# EAGLE design simpleL6470_v2 (EAGLE 9.1.1)
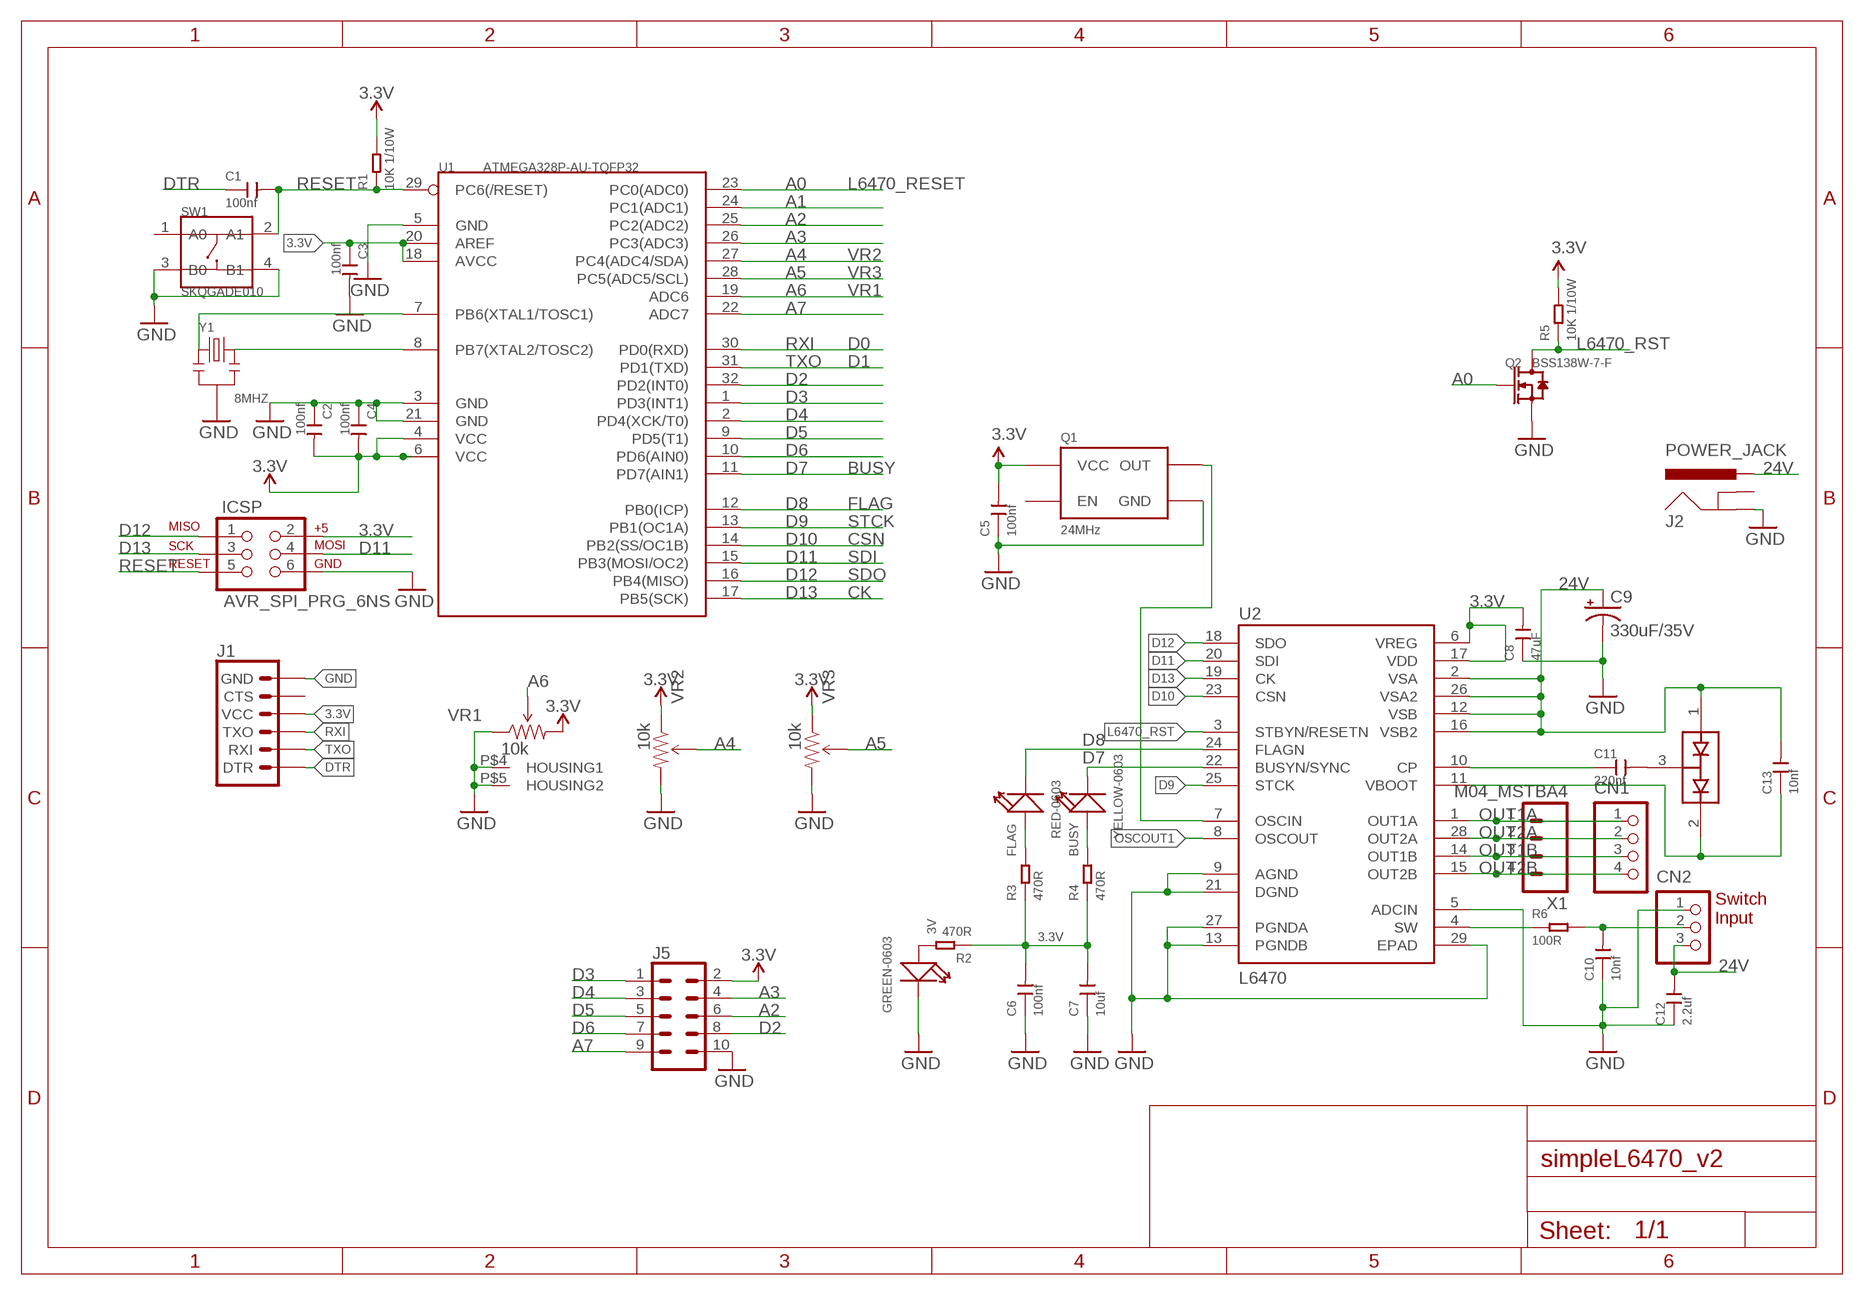
[diagram p0: schematic, sheet 1]

## Parts
3V  GREEN-0603  SMD-LED-CLEAR-GREEN(0603)  [LED-0603]
BUSY  YELLOW-0603  SMD-LED-CLEAR-YELLOW(0603)  [LED-0603]
C1  100nf  CERAMIC-100NF-50V-10%-X7R(0603)  [C0603]
C2  100nf  CERAMIC-100NF-50V-10%-X7R(0603)  [C0603]
C3  100nf  CERAMIC-100NF-50V-10%-X7R(0603)  [C0603]
C4  100nf  CERAMIC-100NF-50V-10%-X7R(0603)  [C0603]
C5  100nf  CERAMIC-100NF-50V-10%-X7R(0603)  [C0603]
C6  100nf  CERAMIC-100NF-50V-10%-X7R(0603)  [C0603]
C7  10uf  CERAMIC-10UF-10V-(-20%～+80%)-Y5V(0805)  [C0805]
C8  47uF  CERAMIC-100UF-6.3V-20%-X5R(1206)  [C1206]
C9  330uF/35V  C_POLD10  [NICHICON_D10]
C10  10nf  CERAMIC-10NF-50V-10%-X7R(0603)  [C0603]
C11  220nf  CERAMIC-220NF-25V-10%-X7R(0603)  [C0603]
C12  2.2uf  CERAMIC-2.2UF-25V-10%-X7R(0805)  [C0805]
C13  10nf  CERAMIC-10NF-50V-10%-X7R(0402)  [C0402]
CN1  S4B-XASK-1  [S4B-XASK-1]
CN2  B3B-XASK-1  [B3B-XASK-1]
D4  BAV99  [SOT23]
FLAG  RED-0603  LED-SMD-RED-DIFFUSED(0603)  [LED-0603]
ICSP  AVR_SPI_PRG_6NS  [2X3-NS]
J1  6_PIN_SERIAL_TARGETLOCK  [1X06_LOCK]
J2  POWER_JACK  [POWER_JACK_PTH]
J5  CONN_05X2NO_SILK  [2X5_NOSILK]
Q1  24MHz  CRYSTAL_OSC3.2X2.5  [CRYSTAL-OSC-SMD-3.2X2.5]
Q2  BSS138W-7-F  SMD-MOSFET-N-CH-50V-200MA-BSS138W-7-F(SOT-23)  [SOT-23]
R1  10K 1/10W  SMD-RES-10K-5%-1/10W(0603)  [R0603]
R2  470R  SMD-RES-470R-5%-1/10W(0603)  [R0603]
R3  470R  SMD-RES-470R-5%-1/10W(0603)  [R0603]
R4  470R  SMD-RES-470R-5%-1/10W(0603)  [R0603]
R5  10K 1/10W  SMD-RES-10K-5%-1/10W(0603)  [R0603]
R6  100R  SMD-RES-100R-5%-1/10W(0603)  [R0603]
SW1  SKQGADE010  SMD-BUTTON(4P-5.2X5.2X1.5MM-SKQGADE010)-SKQGADE010  [SW4-SMD-5.2X5.2X1.5MM]
U1  ATMEGA328P-AU-TQFP32  MCU-ATMEGA328P-AU(TQFP32)  [TQFP32-0.8-7X7MM]
U2  L6470  L6470_NO_THERMAL  [HTSSOP28_NO_THERMAL]
VR1  10k  TRIMVR_HOUSING_RK09  [RK09]
VR2  10k  TRIMVR_T73XX  [TRIMMER_T73XX]
VR3  10k  TRIMVR_T73XX  [TRIMMER_T73XX]
X1  M04_MSTBA4  [MSTBA4]
Y1  8MHZ  SMD-CRYSTAL-8MHZ--0.3%-150R(3P-3.6X1.3MM)  [X3-SMD-3.6X1.3X0.8MM]

## Nets
3.3V [GND_]: C2.2 C3.1 C4.2 C5.2 C6.2 C7.2 C8.2 ICSP.2 J1.4(VCC) J5.2 Q1.4(VCC) R1.2 R2.1 R3.1 R4.1 R5.2 U1.4(VCC) U1.6(VCC) U1.18(AVCC) U1.20(AREF) U2.6(VREG) U2.17(VDD) VR1.3(CW) VR2.P$1(CCW) VR3.P$1(CCW)
24V: C9.+ C12.2 C13.2 CN2.3 D4.1(A1) J2.PWR U2.2(VSA) U2.12(VSB) U2.16(VSB2) U2.26(VSA2)
A0: Q2.1(G) U1.23(PC0(ADC0))
A1: U1.24(PC1(ADC1))
A2: J5.6 U1.25(PC2(ADC2))
A3: J5.4 U1.26(PC3(ADC3))
A4: U1.27(PC4(ADC4/SDA)) VR2.P$2(WIPER)
A5: U1.28(PC5(ADC5/SCL)) VR3.P$2(WIPER)
A6: U1.19(ADC6) VR1.2(WIPER)
A7: J5.9 U1.22(ADC7)
D2: J5.8 U1.32(PD2(INT0))
D3: J5.1 U1.1(PD3(INT1))
D4: J5.3 U1.2(PD4(XCK/T0))
D5: J5.5 U1.9(PD5(T1))
D6: J5.7 U1.10(PD6(AIN0))
D7: BUSY.- U1.11(PD7(AIN1)) U2.22(BUSYN/SYNC)
D8: FLAG.- U1.12(PB0(ICP)) U2.24(FLAGN)
D9: U1.13(PB1(OC1A)) U2.25(STCK)
D10: U1.14(PB2(SS/OC1B)) U2.23(CSN)
D11: ICSP.4 U1.15(PB3(MOSI/OC2)) U2.20(SDI)
D12: ICSP.1 U1.16(PB4(MISO)) U2.18(SDO)
D13: ICSP.3 U1.17(PB5(SCK)) U2.19(CK)
DTR: C1.1 J1.1(DTR)
GND: 3V.- C2.1 C3.2 C4.1 C5.1 C6.1 C7.1 C8.1 C9.- C10.1 C12.1 CN2.1 ICSP.6 J1.6(GND) J2.GND J5.10 Q1.2(GND) Q2.2(S) SW1.3(B0) SW1.4(B1) U1.3(GND) U1.5(GND) U1.21(GND) U2.5(ADCIN) U2.9(AGND) U2.13(PGNDB) U2.21(DGND) U2.27(PGNDA) U2.29(EPAD) VR1.1(CCW) VR1.P$4(HOUSING1) VR1.P$5(HOUSING2) VR2.P$3(CW) VR3.P$3(CW) Y1.2
L6470_RST: Q2.3(D) R5.1 U2.3(STBYN/RESETN)
N$1: FLAG.+ R3.2
N$2: BUSY.+ R4.2
N$3: C11.2 D4.3(COM)
N$4: 3V.+ R2.2
N$18: U1.7(PB6(XTAL1/TOSC1)) Y1.1
N$20: U1.8(PB7(XTAL2/TOSC2)) Y1.3
N$42: C11.1 U2.10(CP)
N$44: C13.1 D4.2(C2) U2.11(VBOOT)
N$45: R6.1 U2.4(SW)
N$46: C10.2 CN2.2 R6.2
OSCOUT1: U2.8(OSCOUT)
OUT1A: CN1.1 U2.1(OUT1A) X1.1
OUT1B: CN1.3 U2.14(OUT1B) X1.3
OUT2A: CN1.2 U2.28(OUT2A) X1.2
OUT2B: CN1.4 U2.15(OUT2B) X1.4
QGOUT: Q1.3(OUT) U2.7(OSCIN)
RESET: C1.2 ICSP.5 R1.1 SW1.2(A1) U1.29(PC6(/RESET))
RXI: J1.3(TXO) U1.30(PD0(RXD))
TXO: J1.2(RXI) U1.31(PD1(TXD))
Unconnected: J1.5(CTS) J2.GNDBREAK Q1.1(EN) SW1.1(A0)

## Notes on the sheet
- L6470_RESET
- VR2
- VR3
- VR1
- D0
- D1
- BUSY
- FLAG
- STCK
- CSN
- SDI
- SDO
- CK
- Switch
  Input

## Library data of the parts
3V = Seeed-LED:SMD-LED-CLEAR-GREEN(0603): 304090043; MPN: 19-217-G7C-AN1P2-3T
BUSY = Seeed-LED:SMD-LED-CLEAR-YELLOW(0603): 304090044; MPN: 19-217-Y5C-AM1N1VY-3T
C1-C6 = Seeed-Capacitor:CERAMIC-100NF-50V-10%-X7R(0603): 302010138; MPN: CC0603KRX7R9BB104
C7 = Seeed-Capacitor:CERAMIC-10UF-10V-(-20%～+80%)-Y5V(0805): 302010158; MPN: CC0805ZKY5V6BB106
C8 = Seeed-Capacitor:CERAMIC-100UF-6.3V-20%-X5R(1206): 302010183; MPN: GRM31CR60J107ME39L; VALUE: 100uf
C9 = _kantaParts:C_POL: Nippon Chemi-Con 3300uF/50V KMH50VSSN3300M P-01590 <http://akizukidenshi.com/catalog/g/gP-01590/>
C10 = Seeed-Capacitor:CERAMIC-10NF-50V-10%-X7R(0603): 302010140; MPN: CC0603KRX7R9BB103
C11 = Seeed-Capacitor:CERAMIC-220NF-25V-10%-X7R(0603): 302010073; MPN: CC0603KRX7R8BB224
C12 = Seeed-Capacitor:CERAMIC-2.2UF-25V-10%-X7R(0805): 302010148; MPN: CC0805KKX7R8BB225
C13 = Seeed-Capacitor:CERAMIC-10NF-50V-10%-X7R(0402): 302010006; MPN: CC0402KRX7R9BB103
CN1 = jst-xa:S4B-XASK-1: Wire-to-Board 2.5mm pitch top mount connector Source: http://www.jst-mfg.com/product/pdf/jpn/XA1.pdf http://www.jst-mfg.com/product/detail.php?series=272
CN2 = jst-xa:B3B-XASK-1: Wire-to-Board 2.5mm pitch top mount connector Source: http://www.jst-mfg.com/product/pdf/jpn/XA1.pdf http://www.jst-mfg.com/product/detail.php?series=272
D4 = SparkFun-DiscreteSemi:BAV99: Two small signal silicon diodes connected anode to cathode. Connections to all three nodes available. DIO-10647; PROD_ID: DIO-10647
FLAG = Seeed-LED:LED-SMD-RED-DIFFUSED(0603): 304090042; MPN: 19-217-R6C-AL1M2VY-3T
ICSP = SparkFun-Connectors:AVR_SPI_PRG_6: AVR ISP 6 Pin This is the reduced ISP connector for AVR programming. Common on Arduino. This footprint will take up less PCB space and can be used with a 10-pin to 6-pin adapter such as SKU: BOB-08508 **Special note about "TEST_POINT" package. The stop mask is on the top side, so if you want your programming test points to be on the bottom of your board, make sure to place this package on the bottom side of the board. This also ensure that the orientation to program from the bottom side will be correct.
J1 = SparkFun-Connectors:6_PIN_SERIAL_TARGET: 6-pin header connection for use with the "FTDI BASIC" pinout - TARGET SIDE. Also known as "Arduino Serial Program Header". It is used to mate with our FTDI Basic serial programmers using the Arduino IDE. Note, this device has "TARGET" in the name. It is intended to be used on a design that contains a target micro-controller that you wish to program. The "sister" device, named "CABLE" is inteneded to be used on a design that usually lives on the end of your USB cable and prvides the converter chip (FTDI232 or FTDI231x) to commnicate serial RX/TX. You can populate with some of these: Break Away Headers - Straight <https://www.sparkfun.com/products/116> (PRT-00116) For reference (or to suit your programming needs) check out these designs: SparkFun FTDI Basic Breakout - 5V <https://www.sparkfun.com/products/9716> (DEV-09716) SparkFun FTDI Basic Breakout - 3.3V <https://www.sparkfun.com/products/9873> (DEV-09873) SparkFun FTDI SmartBasic <https://www.sparkfun.com/products/12935> (DEV-12935) SparkFun Beefy 3 - FTDI Basic Breakout <https://www.sparkfun.com/products/13746> (DEV-13746)
J2 = SparkFun-Connectors:POWER_JACK: Power Jack Connector This is the standard 5.5mm barrel jack for power. The PTH is the most common, proven, reliable, footprint. The Slot footprint only works if the mill layer is transmitted to the PCB fab house so be warned. Here are the connectors we sell at SparkFun: DC Barrel Power Jack/Connector <https://www.sparkfun.com/products/119> (PRT-00119) DC Barrel Power Jack/Connector (SMD) <https://www.sparkfun.com/products/12748> (PRT-12748) DC Barrel Jack Adapter - Breadboard Compatible <https://www.sparkfun.com/products/10811> (PRT-10811) It is used on this SparkFun product (and many, many others): SparkFun RedBoard - Programmed with Arduino <https://www.sparkfun.com/products/12757> (DEV-12757) Also, if you need a mating power supply or connector, please check these out: Wall Adapter Power Supply - 9VDC 650mA <https://www.sparkfun.com/products/298> (TOL-00298) DC Barrel Jack Adapter - Male <https://www.sparkfun.com/products/10287> (PRT-10287); PROD_ID: CONN-08197
J5 = SparkFun-Connectors:CONN_05X2: Multi connection point. Often used as Generic Header-pin footprint for 0.1 inch spaced/style header connections For AVR SPI programming port, see special device with nice symbol: "AVR_SPI_PROG_5x2.dev" You can populate with any combo of single row headers, but if you'd like an exact match, check these: 2x5 AVR ICSP Male Header <https://www.sparkfun.com/products/778> (PRT-00778) 2x5 Pin Shrouded Header <https://www.sparkfun.com/products/8506> (PRT-08506) On any of the 0.1 inch spaced packages, you can populate with these: Break Away Headers - Straight <https://www.sparkfun.com/products/116> (PRT-00116) Break Away Male Headers - Right Angle <https://www.sparkfun.com/products/553> (PRT-00553) Female Headers <https://www.sparkfun.com/products/115> (PRT-00115) Break Away Headers - Machine Pin <https://www.sparkfun.com/products/117> (PRT-00117) Break Away Female Headers - Swiss Machine Pin <https://www.sparkfun.com/products/743> (PRT-00743) Special note: the shrouded connector mates well with our 5x2 ribbon cables: 2x5 Pin IDC Ribbon Cable <https://www.sparkfun.com/products/8535> (PRT-08535)
Q1 = _kantaParts:CRYSTAL_OSC
Q2 = Seeed-Transistor:SMD-MOSFET-N-CH-50V-200MA-BSS138W-7-F(SOT-23): 305030000; MPN: BSS138W-7-F
R1 R5 = Seeed-Resistor:SMD-RES-10K-5%-1/10W(0603): 301010293; MPN: RC0603JR-0710KL
R2-R4 = Seeed-Resistor:SMD-RES-470R-5%-1/10W(0603): 301010088; MPN: RC0603JR-07470RL
R6 = Seeed-Resistor:SMD-RES-100R-5%-1/10W(0603): 301010090; MPN: RC0603JR-07100RL
SW1 = Seeed-Switch:SMD-BUTTON(4P-5.2X5.2X1.5MM-SKQGADE010): 311020017; MPN: SKQGADE010
U1 = Seeed-IC:MCU-ATMEGA328P-AU(TQFP32): 310010049; MPN: ATMEGA328P-AU
U2 = SparkFun-PowerIC:L6470: 3A RMS/7A peak bipolar stepper motor driver with SPI control and step input in HTSSOP-28 package. IC-10648
VR1 = _kantaParts:TRIMVR_HOUSING: Trimmer VR with housing terminal RK09 ALPS without center click : RS 154-8162 <https://jp.rs-online.com/web/p/potentiometers/1548162/> with center click : RS 729-3603 <https://jp.rs-online.com/web/p/potentiometers/7293603/>
VR2 VR3 = _kantaParts:TRIMVR: SUNTAN 3386K Series Akiduki : P-06110 <http://akizukidenshi.com/catalog/g/gP-06110/> SMD VR ST-32EB Copal Electronics / Surface Mount Trimmer RS : 474-8706 Trimmer BOURNS 3392P Series Akiduki P-03277 <http://akizukidenshi.com/catalog/g/gP-03277/> details : http://www.bourns.com/pdfs/3362.pdf
X1 = _kantaParts:M04: Round Pin Socket with slim pads Akiduki P-01015 <http://akizukidenshi.com/catalog/g/gP-01015/>
Y1 = Seeed-Crystal Oscillator:SMD-CRYSTAL-8MHZ--0.3%-150R(3P-3.6X1.3MM): 306010053

## Board
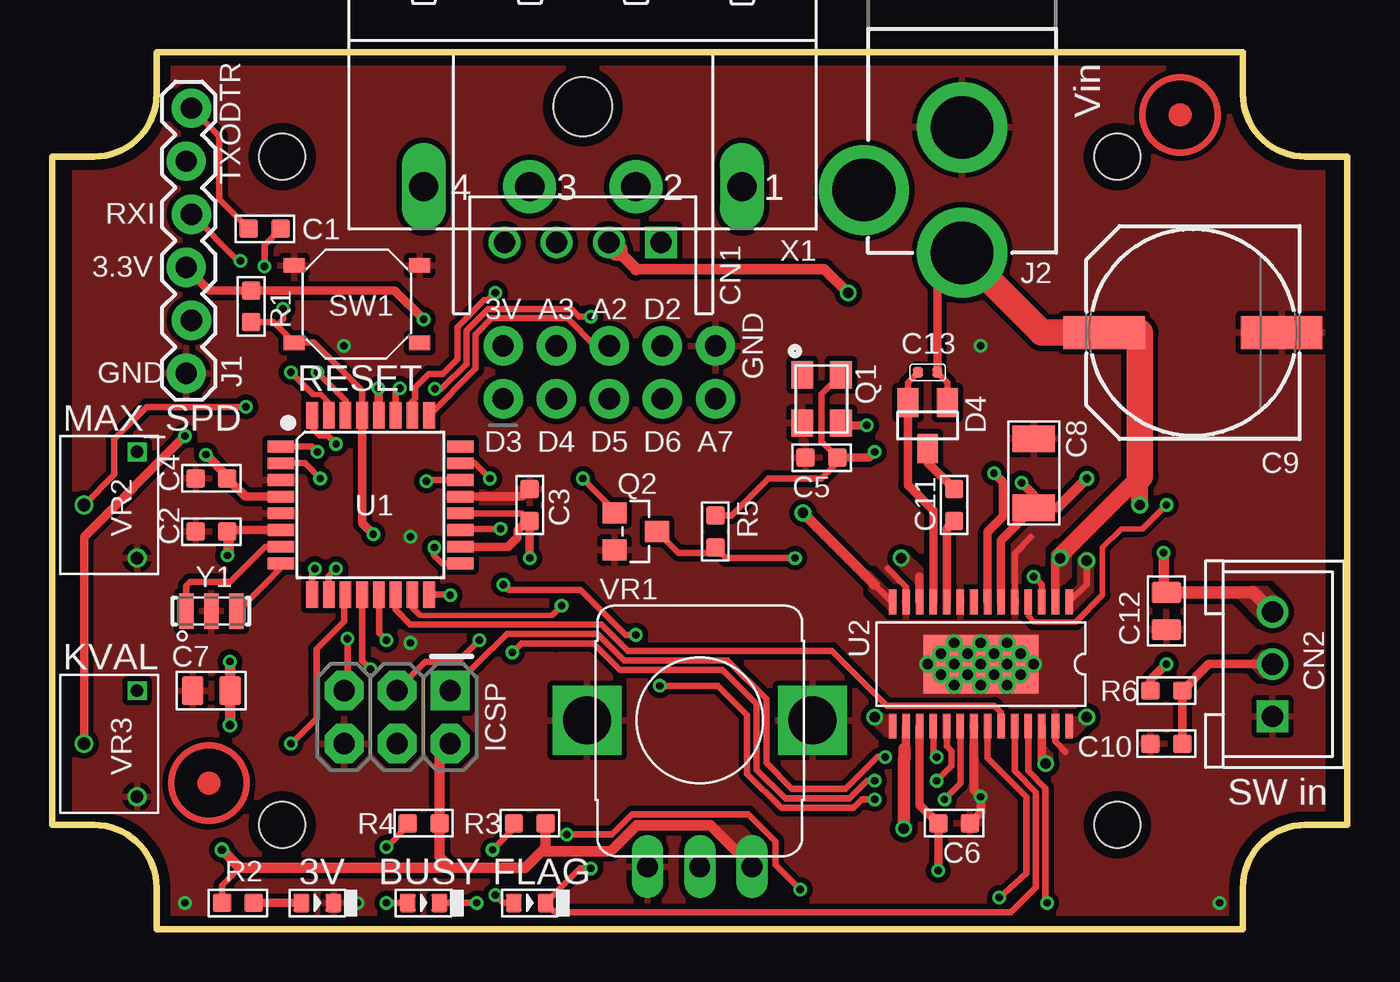
[diagram p1: board, top side]
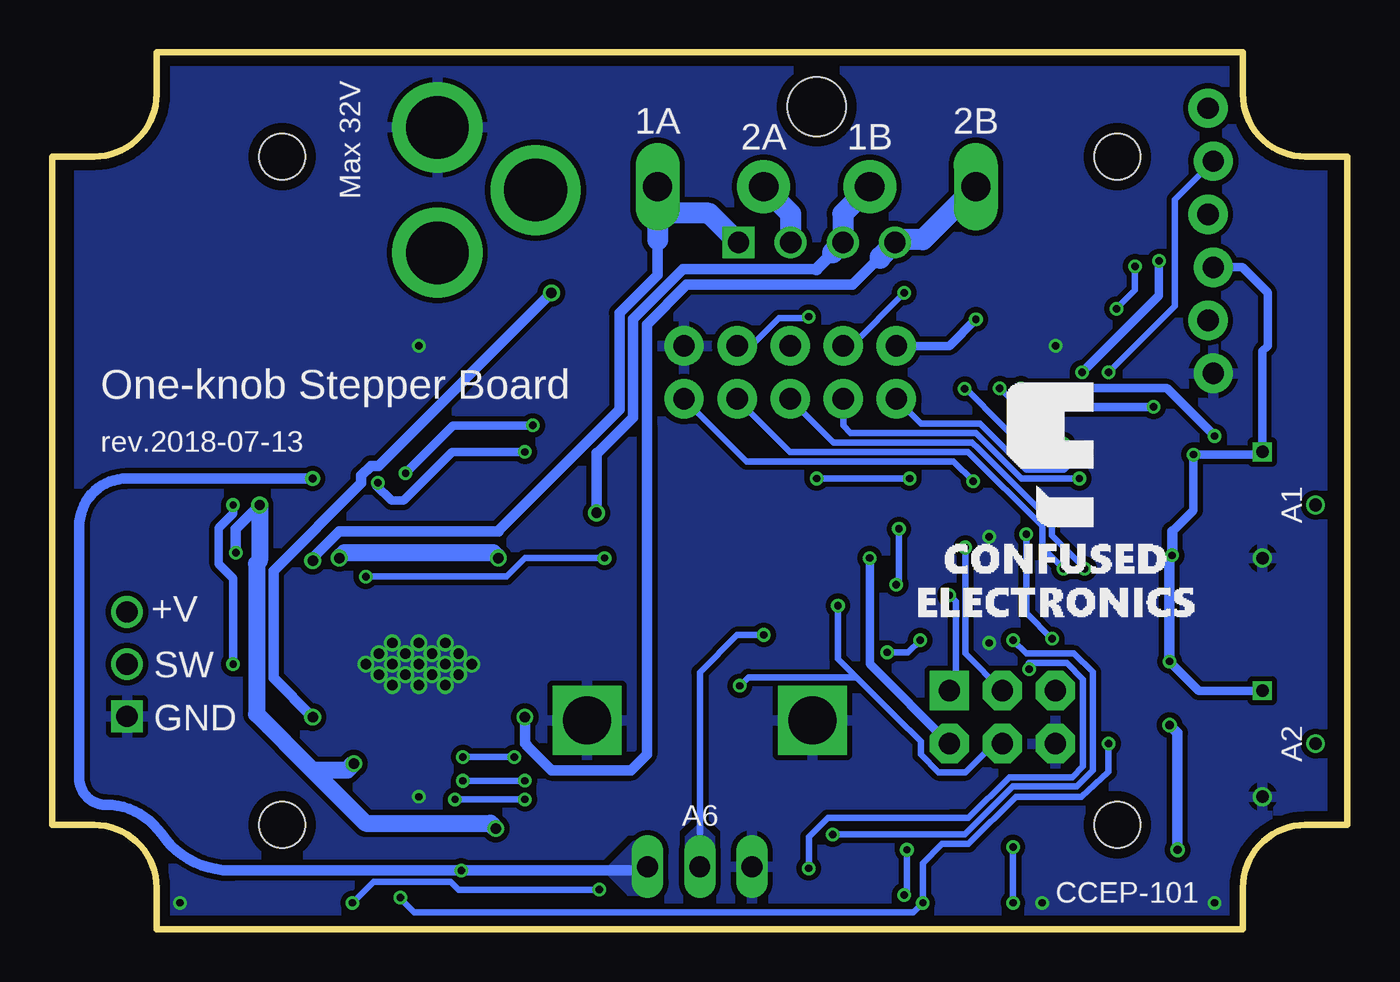
[diagram p2: board, bottom side, seen from below]

Size 62 x 42 mm. Coordinates in mm from the lower left corner, seen from the top.
Outline: 0,5 2,5 arc-90 5,2 5,0 57,0 57,2 arc-90 60,5 62,5 62,37 60,37 arc-90 57,40 57,42 5,42 5,40 arc-90 2,37 0,37 0,5
Copper layers (1*16): Top 0.035mm / dielectric 1.53mm / Bottom 0.035mm
Design rules "pban_5mil-l2": minimum track width 5mil, minimum drill 0.3mm, track to track 5mil, track to pad 0.229mm, pad to pad 5mil, via to via 5mil, smd to smd 5mil, copper to edge 0.5mm, drill to drill 0.5mm, minimum pad ring 0.15mm, minimum via ring 0.15mm, stop-mask expansion 4mil, vias tented up to drill 0.35mm, thermal gap 10mil
Holes 2.2 mm at 11,5 51,5 11,37 51,37
tRestrict: area 61.2,5 to 62,37; area 0,5 to 0.7,37
bRestrict: area 61.2,5 to 62,37; area 0,5 to 0.7,37

### Footprints (pad centres in the part's own frame; a part is rotated, then mirrored left to right if it is on the bottom)
LED-0603 = smd 0.762 x 0.889: + -0.762,0; - 0.762,0
C0603 = smd 0.889 x 0.889: 1 0,0.762; 2 0,-0.762
C0805 = smd 1.397 x 1.016: 1 0,0.889; 2 0,-0.889
C1206 = smd 1.27 x 2.032: 1 -1.651,0; 2 1.651,0
NICHICON_D10 = smd 3.9 x 1.6: + 4.25,0; - -4.25,0
C0402 = smd 0.5 x 0.5: 1 0,0.463; 2 0,-0.463
S4B-XASK-1 = drill 1.016 square: 1 3.75,0 | drill 1.016: 2 1.25,0; 3 -1.25,0; 4 -3.75,0 | hole 2.8: 0,6.5
B3B-XASK-1 = drill 1.016 square: 1 -2.5,0 | drill 1.016: 2 0,0; 3 2.5,0
SOT23 = smd 1 x 1.4: 1 -0.95,-1.1; 2 0.95,-1.1; 3 0,1.1
2X3-NS = drill 1.016 pad 1.88 square: 1 -2.54,-1.27 | drill 1.016 pad 1.88 octagon: 2 -2.54,1.27; 3 0,-1.27; 4 0,1.27; 5 2.54,-1.27; 6 2.54,1.27
1X06_LOCK = drill 1.016 pad 1.88: 1 0,0; 2 2.54,-0.254; 3 5.08,0; 4 7.62,-0.254; 5 10.16,0; 6 12.7,-0.254
POWER_JACK_PTH = drill 2.997 pad 4.318: GND 0,7.7; GNDBREAK 4.7,10.7; PWR 0,13.7
2X5_NOSILK = drill 1.016 pad 1.88: 1 0,0; 2 0,2.54; 3 2.54,0; 4 2.54,2.54; 5 5.08,0; 6 5.08,2.54; 7 7.62,0; 8 7.62,2.54; 9 10.16,0; 10 10.16,2.54
CRYSTAL-OSC-SMD-3.2X2.5 = smd 1.3 x 1.05: 1 -1.15,-0.925; 2 1.15,-0.925; 3 1.15,0.925; 4 -1.15,0.925
SOT-23 = smd 1.016 x 1.143: 1 -0.889,-1.016; 2 0.889,-1.016; 3 0,1.016
R0603 = smd 0.889 x 0.889: 1 0,0.762; 2 0,-0.762
SW4-SMD-5.2X5.2X1.5MM = smd 1 x 0.7: 1 -3,1.85; 2 3,1.85; 3 -3,-1.85; 4 3,-1.85
TQFP32-0.8-7X7MM = smd 1.27 x 0.559: 1 -4.293,2.8; 2 -4.293,2; 3 -4.293,1.2; 4 -4.293,0.4; 5 -4.293,-0.4; 6 -4.293,-1.2; 7 -4.293,-2; 8 -4.293,-2.8; 17 4.293,-2.8; 18 4.293,-2; 19 4.293,-1.2; 20 4.293,-0.4; 21 4.293,0.4; 22 4.293,1.2; 23 4.293,2; 24 4.293,2.8 | smd 0.559 x 1.27: 9 -2.8,-4.293; 10 -2,-4.293; 11 -1.2,-4.293; 12 -0.4,-4.293; 13 0.4,-4.293; 14 1.2,-4.293; 15 2,-4.293; 16 2.8,-4.293; 25 2.8,4.293; 26 2,4.293; 27 1.2,4.293; 28 0.4,4.293; 29 -0.4,4.293; 30 -1.2,4.293; 31 -2,4.293; 32 -2.8,4.293
HTSSOP28_NO_THERMAL = smd 0.36 x 1.19: 1 -4.225,-2.97; 2 -3.575,-2.97; 3 -2.925,-2.97; 4 -2.275,-2.97; 5 -1.625,-2.97; 6 -0.975,-2.97; 7 -0.325,-2.97; 8 0.325,-2.97; 9 0.975,-2.97; 10 1.625,-2.97; 11 2.275,-2.97; 12 2.925,-2.97; 13 3.575,-2.97; 14 4.225,-2.97; 15 4.225,2.97; 16 3.575,2.97; 17 2.925,2.97; 18 2.275,2.97; 19 1.625,2.97; 20 0.975,2.97; 21 0.325,2.97; 22 -0.325,2.97; 23 -0.975,2.97; 24 -1.625,2.97; 25 -2.275,2.97; 26 -2.925,2.97; 27 -3.575,2.97; 28 -4.225,2.97 | smd 5.5 x 2.8: 29 0,0
RK09 = drill 1 long: 1 -2.5,-7; 2 0,-7; 3 2.5,-7 | drill 2.3 square: P$4 -5.4,0; P$5 5.4,0
TRIMMER_T73XX = drill 0.6 square: P$1 -2.54,-2.54 | drill 0.6: P$2 0,0; P$3 -2.54,2.54
MSTBA4 = drill 1.397 long: 1 -7.62,5.08; 4 7.62,5.08 | drill 1.397 pad 2.54: 2 -2.54,5.08; 3 2.54,5.08
X3-SMD-3.6X1.3X0.8MM = smd 0.7 x 1.7: 1 -1.2,0; 2 0,0; 3 1.2,0

### Placement (x,y rotation side)
3V  12.7,1.27 0 top
BUSY  17.78,1.27 0 top
C1  10.18,33.54 90 top
C2  7.62,19.05 90 top
C3  22.86,20.32 180 top
C4  7.62,21.59 90 top
C5  36.83,22.59 90 top
C6  43.18,5.08 270 top
C7  7.62,11.43 90 top
C8  46.99,21.84 270 top
C9  54.61,28.57 180 top
C10  53.34,8.89 90 top
C11  43.18,20.32 180 top
C12  53.34,15.24 180 top
C13  41.91,26.67 90 top
CN1  25.4,32.89 0 top
CN2  58.42,12.7 90 top
D4  41.91,24.13 180 top
FLAG  22.86,1.27 0 top
ICSP  16.51,10.16 180 top
J1  6.67,39.32 270 top
J2  43.56,46.1 180 top
J5  21.59,25.4 0 top
Q1  36.83,25.4 270 top
Q2  27.94,19.05 270 top
R1  9.52,29.83 180 top
R2  8.89,1.27 90 top
R3  22.86,5.08 270 top
R4  17.78,5.08 270 top
R5  31.75,19.05 180 top
R6  53.34,11.43 90 top
SW1  14.59,29.94 180 top
U1  15.24,20.32 0 top
U2  44.45,12.7 180 top
U$2  [FIDUCIAL_MARKER_PBAN]  7.5,7 0 top
U$3  [FIDUCIAL_MARKER_PBAN]  54,39 0 top
U$4  [CONFUSEDELECTRONICS_LOGO_12MM]  21.59,13.97 0 bottom
VR1  31,10 0 top
VR2  1.52,20.32 180 top
VR3  1.52,8.89 180 top
X1  25.4,40.64 180 top
Y1  7.62,15.24 0 top

### Tracks (layer width: path | path; a pad name or v marks a point on that pad's centre or on a via)
3.3V  (via drill 0.35, 0.4)
  Top 0.305: R5.2 32.51,19.81 34.29,21.59 36.83,21.59 37.83,22.59 38.1,22.59 | U1.20 22.5,19.92 22.8,19.62 | C5.2 36.83,23.35 36.83,25.62 Q1.4 | R2.1 8.13,2.11 8.98,2.96
  Top 0.406: U2.6 45.42,18.63 C8.2 46.99,20.81 v46.41,21.39 | v22.86,17.78 C3.1 22.8,19.62 22.27,19.1 22.27,18.77 21.83,18.32 U1.18 | v42.42,2.82 C6.2 41.52,5.97 U2.17 | C5.2 38.1,22.59 39.1,22.59 v39.37,22.86 | C2.2 8.45,19.12 U1.6 | U1.4 9.25,20.72 C4.2 8.38,21.72 v7.37,22.73 | J1.4 7.52,30.59 R1.2 16.4,30.59 v17.78,29.21
  Top 0.5: 27.99,4.98 27.98,4.98 26.74,3.74 23.43,3.74 23.18,3.49
  Top 0.508: 19.05,2.96 10.16,2.96 8.98,2.96 v8.13,3.81 | 19.05,2.96 22.65,2.96 23.18,3.49 23.62,3.94 R3.1 | 19.05,2.96 18.54,3.47 R4.1 18.54,8.38 ICSP.2 | v8.51,12.83 C7.2 v8.51,9.78 | v8.38,17.91 8.45,17.98 8.45,19.12 | v49.53,21.59 48.13,20.19 C8.2 | VR1.3 31.51,4.98 27.99,4.98
  Bottom 0.406: ICSP.2 22.86,12.7 v22.86,17.78 | v46.41,21.39 46.51,21.29 45.75,20.53 45.18,20.53 42.85,22.86 v39.37,22.86 | J1.4 5.03,31.7 3.81,30.48 3.81,27.94 4.06,27.69 VR2.P$1 4.19,22.73 v7.37,22.73 7.37,20.07 C2.2 | VR3.P$1 7.11,11.43 v8.51,12.83 | v17.78,29.21 19.05,27.94 J5.2
  Bottom 0.5: 60.71,19.3 60.71,19.05 | 60.71,19.05 60.71,7.62 60.71,7.24 arc-90 59.44,5.97 arc55 56.77,4.57 arc-55 53.47,2.82 | 60.71,19.05 60.71,19.3 | 60.71,19.3 arc90 58.42,21.59
  Bottom 0.508: v49.53,21.59 58.42,21.59 | v8.51,12.83 8.51,17.78 v8.38,17.91 C2.2 | 53.47,2.82 53.34,2.82 v42.42,2.82 33.68,2.82 VR1.3 | v8.13,3.81 8.13,9.4 v8.51,9.78
  pour Top (isolate 0.254, no thermals): 33.4,3.05 31.62,4.83 31.62,4.95 33.02,4.95 33.66,4.32 33.66,3.17 33.53,3.05
  pour Bottom (isolate 0.254, no thermals): 33.53,4.19 33.53,1.65 34.42,1.65 35.56,2.79 34.16,4.19
24V  (via drill 0.35, 0.5)
  Top 0.305: D4.1 42.86,26.18 C13.2
  Top 0.406: U2.12 41.52,16.89 | U2.16 40.88,8.72 40.79,8.64 | U2.2 48.02,17.67 48.26,17.91 | v47.56,7.94 47.38,8.12 U2.26 | C13.2 42.37,31.21 J2.PWR
  Top 0.508: v48.26,17.78 48.26,17.91 | v53.21,18.03 53.21,16.26 C12.2
  Top 0.61: C12.2 57.49,16.13 CN2.3 | v40.77,4.83 40.77,8.16 40.79,8.18 40.79,8.64
  Top 0.813: 48.26,17.91 52.07,21.72 v52.07,20.32
  Top 1.27: J2.PWR 47.39,28.57 C9.+ 52.07,28.57 52.07,21.72
  Bottom 0.508: v53.21,18.03 53.21,19.18 v52.07,20.32
  Bottom 0.813: v52.07,20.32 52.07,17.66 52.22,17.51 52.22,10.31 49.53,7.62 | 49.53,7.62 46.99,5.08 41.02,5.08 v40.77,4.83 | v47.56,7.94 47.88,7.62 49.53,7.62 | v40.64,17.78 40.89,18.03 48.01,18.03 v48.26,17.78
  pour Top (isolate 0.254, no thermals): 40.39,17.53 41.4,16.51 41.66,16.51 41.66,17.27 40.89,18.03 40.64,18.03 40.39,17.78
  pour Top (isolate 0.254, rank 2, no thermals): 48.77,18.41 48.77,17.02 48.77,16.89 48.13,16.26 47.88,16.26 47.88,18.03 48.26,18.41
  pour Top (isolate 0.254, rank 3, no thermals): 58.42,15.24 58.8,15.62 58.8,15.75 58.17,16.38 57.4,16.38 57.02,16 56.64,16 57.91,14.73 58.04,14.73 58.42,15.11
  pour Top (isolate 0.254, rank 3, no thermals): 47.37,7.75 47.88,8 47.88,8.38 47.5,8.76 47.24,8.89 47.24,7.87
A0  (via drill 0.35)
  Top 0.305: U1.23 20.23,22.32 v20.95,21.59 | v25.4,21.59 26.92,20.07 Q2.1
  Bottom 0.305: v20.95,21.59 v25.4,21.59
A2
  Top 0.305: J5.6 26,27.94 24.68,29.26 21.04,29.26 20.27,28.49 20.27,26.84 U1.25
A3  (via drill 0.35)
  Top 0.305: v21.21,30.48 20.85,30.12 20.68,30.12 19.41,28.84 19.41,27.3 18.69,26.59 18.02,26.59 17.38,25.95 17.38,25.41 17.24,25.27 U1.26
  Bottom 0.305: v21.21,30.48 23.75,27.94 J5.4
A4  (via drill 0.35)
  Top 0.305: U1.27 16.44,25.71 v16.64,25.91 | VR2.P$2 2.98,21.77 2.98,23.47 4.53,25.02 v9.27,25.02
  Bottom 0.305: v16.64,25.91 15.75,25.02 13.97,25.02
  Bottom 0.406: 13.97,25.02 v9.27,25.02
A5  (via drill 0.35)
  Top 0.406: v6.35,23.62 1.52,18.8 VR3.P$2 | v15.62,25.91 15.62,24.63 U1.28
  Bottom 0.406: v6.35,23.62 8.64,25.91 v15.62,25.91
A6  (via drill 0.35)
  Top 0.305: v21.46,19.18 19.59,19.18 U1.19 | v27.94,14.1 27.44,14.1 25.29,16.25 21.85,16.25 v21.59,16.51
  Bottom 0.305: v21.46,19.18 21.46,16.64 v21.59,16.51 | VR1.2 31,12.31 29.21,14.1 v27.94,14.1
  pour Bottom (isolate 0.254, no thermals): 30.35,3.81 31.62,3.81 31.62,4.45 30.99,5.08 30.35,4.45
A7  (via drill 0.35)
  Top 0.305: U1.22 17.96,21.52 v17.91,21.46
  Bottom 0.305: v17.91,21.46 18.85,22.4 28.75,22.4 J5.9
D2  (via drill 0.35)
  Top 0.254: v13.59,23.24 13.21,23.62 12.81,23.62 12.44,24 U1.32
  Top 0.305: v25.78,29.34 25.21,29.34 24.86,29.69 20.86,29.69 19.84,28.67 19.84,27.08 18.64,25.88 v18.31,25.88
  Bottom 0.305: v13.59,23.24 15.62,23.24 16.51,24.13 18.26,25.88 v18.31,25.88 | J5.8 28.54,27.94 27.22,29.26 25.86,29.26 v25.78,29.34
D3  (via drill 0.35)
  Top 0.305: U1.1 12.44,23.12 v12.7,22.86
  Bottom 0.254: 16.22,22.86 15.35,22 13.56,22 v12.7,22.86
  Bottom 0.305: 16.22,22.86 17.59,24.23 20.42,24.23 J5.1
D4  (via drill 0.35)
  Top 0.305: U1.2 12.1,22.32 v12.83,21.59
  Bottom 0.305: v12.83,21.59 15.59,21.59 17.78,23.77 23.77,23.77 24.13,24.13 J5.3
D5  (via drill 0.35)
  Top 0.305: U1.9 12.44,17.14 v12.57,17.27
  Bottom 0.305: v12.57,17.27 14.15,18.85 14.15,19.5 17.64,23 | 17.64,23 17.97,23.32 | 17.64,23 17.97,23.32 | J5.5 24.59,23.32 17.97,23.32
D6  (via drill 0.35)
  Top 0.305: U1.10 13.24,16.92 v13.59,17.27
  Bottom 0.305: v13.59,17.27 14.61,18.29 14.61,19.31 18.16,22.86 26.67,22.86 J5.7
D7  (via drill 0.35)
  Top 0.305: BUSY.- v20.32,1.27 | v45.34,1.52 46.63,2.69 46.63,6.35 44.77,8.21 U2.22 | U1.11 13.97,15.96 13.97,14.75 12.65,13.43 12.65,11.43 12.65,10.11 v11.43,8.89
  Bottom 0.305: v45.34,1.52 45.3,1.43 44.68,0.81 20.77,0.81 v20.32,1.27 20.32,3.17 19.41,4.09 18.13,4.09 15.86,6.35 12.72,6.35 11.43,7.54 v11.43,8.89
D8  (via drill 0.35)
  Top 0.305: U2.24 46.08,7.58 47.09,6.57 47.09,2.01 46.04,0.95 45.9,0.82 24.07,0.82 FLAG.- 25.27,2.92 v25.78,2.92 | U1.12 14.84,12.85 v15.23,12.45
  Bottom 0.305: v25.78,2.92 25.78,4.42 24.87,5.33 19.05,5.33 18.14,5.33 16.18,7.29 13.16,7.29 12.65,7.8 12.65,11.98 13.42,12.75 15.23,12.75 v15.23,12.45
D9  (via drill 0.35)
  Top 0.305: U2.25 46.73,7.58 47.55,6.75 47.55,1.35 v47.62,1.27 | v16,13.84 15.64,14.21 U1.13 | v35.81,1.91 34.63,3.09 34.63,3.81 | 34.63,3.81 34.63,4.22 | 34.63,3.81 34.63,4.22 | v24.64,4.54 26.8,4.54 27.77,5.52 33.33,5.52 34.63,4.22
  Bottom 0.305: v24.64,4.54 18.32,4.54 16,6.86 12.95,6.86 12.19,7.62 12.19,12.32 13.08,13.21 15.37,13.21 v16,13.84 | v35.81,1.91 42.55,1.91 42.93,2.29 46.61,2.29 v47.62,1.27
D10
  Top 0.305: U1.14 16.44,15.31 17.14,14.61 26.29,14.61 27.56,13.33 37.34,13.33 39.97,10.71 45.11,10.71 45.42,10.39 U2.23
D11  (via drill 0.35)
  Top 0.254: 17.61,15.04 17.59,15.05 | 17.59,15.05 17.24,15.41 U1.15 | 17.59,15.05 17.61,15.04 | v24.38,15.49 23.93,15.04 17.61,15.04
  Top 0.305: U2.20 43.48,6.98 v42.72,6.22 | v29.08,11.66 31.88,11.66 33.27,10.27 33.27,7.46 34.91,5.82 38.35,5.82 38.76,6.22 v39.37,6.22
  Bottom 0.305: ICSP.4 16.91,8.89 18.28,7.52 19.57,7.52 20.42,8.37 20.42,8.99 21.59,10.16 23.5,12.06 | 23.5,12.06 24.38,12.95 v24.38,15.49 | v39.37,6.22 v42.72,6.22 | v29.08,11.66 28.68,12.06 23.5,12.06
D12  (via drill 0.35)
  Top 0.305: U2.18 42.17,8.41 v42.34,8.26 | v19.05,16 19.02,16.03 U1.16 | ICSP.1 20.32,12.7 21.77,14.15 26.1,14.15 27.37,12.88 32.34,12.88 34.18,11.03 34.18,7.96 35.41,6.73 37.97,6.73 39.5,8.26 v39.88,8.26
  Bottom 0.305: v19.05,16 18.75,15.7 18.75,11.73 ICSP.1 | v39.88,8.26 v42.34,8.26
D13  (via drill 0.35)
  Top 0.305: v18.29,18.29 18.29,17.91 18.68,17.52 U1.17 | v39.37,7.12 39,7.12 38.16,6.27 35.1,6.27 33.73,7.64 33.73,10.79 32.1,12.42 27.18,12.42 25.91,13.69 24.13,13.69 22.46,13.69 v22.03,13.26 | v20.45,13.84 19.41,12.8 17.86,12.8 16.51,11.46 ICSP.3 | U2.19 42.83,8.76 43.04,8.55 43.04,7.82 v42.34,7.11
  Bottom 0.305: v42.34,7.11 v39.37,7.11 v39.37,7.12 | ICSP.3 18.29,13.21 v18.29,18.29 | v22.03,13.26 21.03,13.26 v20.45,13.84
DTR
  Top 0.305: C1.1 8,34.95 8,37.99 J1.1
GND  (via drill 0.35, 0.5)
  Top 0.305: U2.5 46.08,18.01 46.86,18.8 | U2.13 40.88,16.4 40.01,17.27 | U2.27 48.02,9 48.51,8.51
  Top 0.406: U1.21 22.5,20.72 C3.2 | U2.21 44.12,6.67 v44.45,6.35 44.45,5.59 C6.1
  other vias: 17.14,13.72 55.88,1.27 41.91,12.7 43.18,12.7 44.45,12.7 45.72,12.7 46.99,12.7 46.35,13.21 45.09,13.21 43.81,13.21 42.55,13.21 42.55,12.19 43.81,12.19 45.09,12.19 46.35,12.19 45.72,11.68 44.45,11.68 43.18,11.68 43.18,13.72 44.45,13.72 45.72,13.72 6.35,1.27 13.97,27.94 14.61,1.27 17.14,18.8 44.45,27.94
  pour Top (isolate 0.254, rank 6): 0,0 62,0 62,42 0,42
  pour Bottom (isolate 0.254, rank 2): 0,0 62,0 62,42 0,42
L6470_RST  (via drill 0.35)
  Top 0.305: U2.3 47.38,16.51 v46.99,16.89 | R5.1 32,18.03 | 32,18.03 32.26,17.78 v35.56,17.78 | Q2.3 29.97,18.03 32,18.03
  Bottom 0.305: v46.99,16.89 40.26,16.89 39.37,17.78 v35.56,17.78
N$1  (via drill 0.35)
  Top 0.305: v21.21,1.65 21.59,1.27 FLAG.+ | v21.08,3.81 22.1,4.83 R3.2
  Bottom 0.305: v21.08,3.81 21.08,1.78 v21.21,1.65
N$2  (via drill 0.35)
  Top 0.305: v16,1.27 BUSY.+ | v16,3.94 17.02,4.95 R4.2
  Bottom 0.305: v16,3.94 v16,1.27
N$3
  Top 0.406: D4.3 41.91,22.35 C11.2
N$4
  Top 0.406: R2.2 3V.+
N$18
  Top 0.305: U1.7 10.19,18.32 8.51,16.64 6.6,16.64 6.42,16.45 Y1.1
N$20
  Top 0.305: U1.8 10.95,17.3 10.16,16.51 8.89,15.24 Y1.3
N$42
  Top 0.406: U2.10 42.83,19.2 C11.1
N$44
  Top 0.305: D4.2 40.96,26.18 C13.1
  Top 0.406: D4.2 40.96,21.27 42.17,20.05 U2.11
N$45  (via drill 0.35)
  Top 0.254: U2.4 46.73,15 47,14.72 49,14.72 50.29,16 50.29,18.28 51.18,19.18 52.2,19.18 v53.34,20.32
  Top 0.406: R6.1 52.58,11.94 v53.34,12.7
  Bottom 0.406: v53.34,20.32 53.34,19.91 54.02,19.23 54.02,17.5 53.34,16.81 v53.34,12.7
N$46
  Top 0.406: CN2.2 57.15,12.7 55.37,12.7 R6.2 C10.2
  pour Top (isolate 0.254, rank 3, no thermals): 58.29,13.34 58.29,12.06 57.91,12.06 57.28,12.7 57.91,13.34
OUT1A  (via drill 0.5)
  Top 0.305: U2.1 49.53,16.52 v49.53,17.65
  Bottom 0.508: v49.53,17.65 49.53,17.78 48.26,19.05 40.64,19.05 40.64,19.1 34.85,24.89 34.85,29.5 33.02,31.33 33.02,33.02
  Bottom 1.016: X1.1 33.02,34.29 | 33.02,34.29 33.02,33.02 | CN1.1 30.55,34.29 33.02,34.29
  pour Top (isolate 0.254, no thermals): 48.77,16.13 49.15,16.51 49.15,17.65 49.15,17.78 49.4,18.03 49.53,18.03 49.78,17.78 49.78,17.65 49.78,16.13 48.9,15.24 48.77,15.24
OUT1B  (via drill 0.5)
  Top 0.254: 39.37,16.51 40.21,15.67 U2.14
  Top 0.508: v35.94,19.94 39.37,16.51
  Bottom 0.508: v35.94,19.94 35.94,22.82 35.88,22.82 34.19,24.51 34.19,29.23 31.8,31.62 25.42,31.62
  Bottom 0.61: 24.64,32.38 24.66,32.38 25.42,31.62
  Bottom 1.016: X1.3 24.15,34.27 CN1.3 24.64,32.41 24.64,32.38
  pour Top (isolate 0.254, no thermals): 40.13,16.13 39.12,17.14 39.12,16.26 40.13,15.24
OUT2A  (via drill 0.5)
  Top 0.508: v38.1,30.48 36.96,31.62 27.94,31.62
  Top 0.61: 27.05,32.51 27.94,31.62
  Top 1.016: CN1.2 27.03,32.51 27.05,32.51
  Bottom 0.508: v49.53,10.16 51.41,12.04 51.41,17.17 47.22,21.36 47.22,21.72 46.74,22.2 46.38,22.2 v38.1,30.48
  Bottom 1.016: X1.2 26.65,34.27 CN1.2
  pour Top (isolate 0.254, no thermals): 48.64,10.16 49.15,10.16 49.4,10.41 49.66,10.41 49.78,10.29 49.78,10.16 49.78,10.03 49.66,9.91 49.02,9.27 48.64,9.27
OUT2B  (via drill 0.5)
  Bottom 0.508: v39.37,10.16 39.37,8.91 39.27,8.81 39.27,8.79 38.1,7.62 34.29,7.62 33.53,8.38 33.53,24.13 33.53,28.96 31.62,30.86 23.68,30.86 22.41,32.13 22.35,32.13
  Bottom 1.016: X1.4 20.32,33.02 21.59,33.02 21.65,32.96 CN1.4 22.35,32.19 22.35,32.13
  pour Top (isolate 0.254, no thermals): 40.26,10.16 40.01,10.41 39.37,10.41 39.24,10.41 39.12,10.29 39.12,10.03 39.88,9.27 40.26,9.27
QGOUT  (via drill 0.35)
  Top 0.406: U2.7 44.77,19.02 45.52,19.76 45.52,21.41 v45.09,21.84 | v38.99,24.13 37.88,24.13 Q1.3
  Bottom 0.406: v45.09,21.84 42.8,24.13 v38.99,24.13
RESET  (via drill 0.35)
  Top 0.305: R1.1 10.61,29.07 10.76,28.92 | 10.76,28.92 SW1.2 12.55,28.09 14.84,25.8 U1.29 | C1.2 10.16,32.77 v10.16,31.75 | v11.05,29.72 11.05,29.21 10.76,28.92 | v14.13,13.91 14.13,11.59 ICSP.5
  Top 0.406: v15.37,18.92 14.84,19.45 U1.29
  Bottom 0.305: v10.16,31.75 10.16,30.61 v11.05,29.72 | v15.37,18.92 15.37,15.15 v14.13,13.91
RXI  (via drill 0.35)
  Top 0.305: v12.7,26.67 14.04,25.33 U1.30 | J1.3 8.9,32 v9.02,32
  Bottom 0.406: v9.02,32 9.02,30.35 v12.7,26.67
TXO  (via drill 0.35)
  Top 0.254: v11.43,26.67 12.5,25.6 12.87,25.6 13.24,25.23 U1.31
  Bottom 0.305: J1.2 8.26,34.94 8.26,29.84 v11.43,26.67

### Text on the board
tPlace: DTR | Vin | TXO | RXI | 3.3V | 3V | A3 | A2 | D2 | GND | GND | RESET | MAX_SPD | D3 | D4 | D5 | D6 | A7 | KVAL | SW in
bPlace: Max 32V | 2B | 1A | 1B | 2A | One-knob Stepper Board | rev.2018-07-13 | A1 | +V | SW | GND | A2 | A6 | CCEP-101